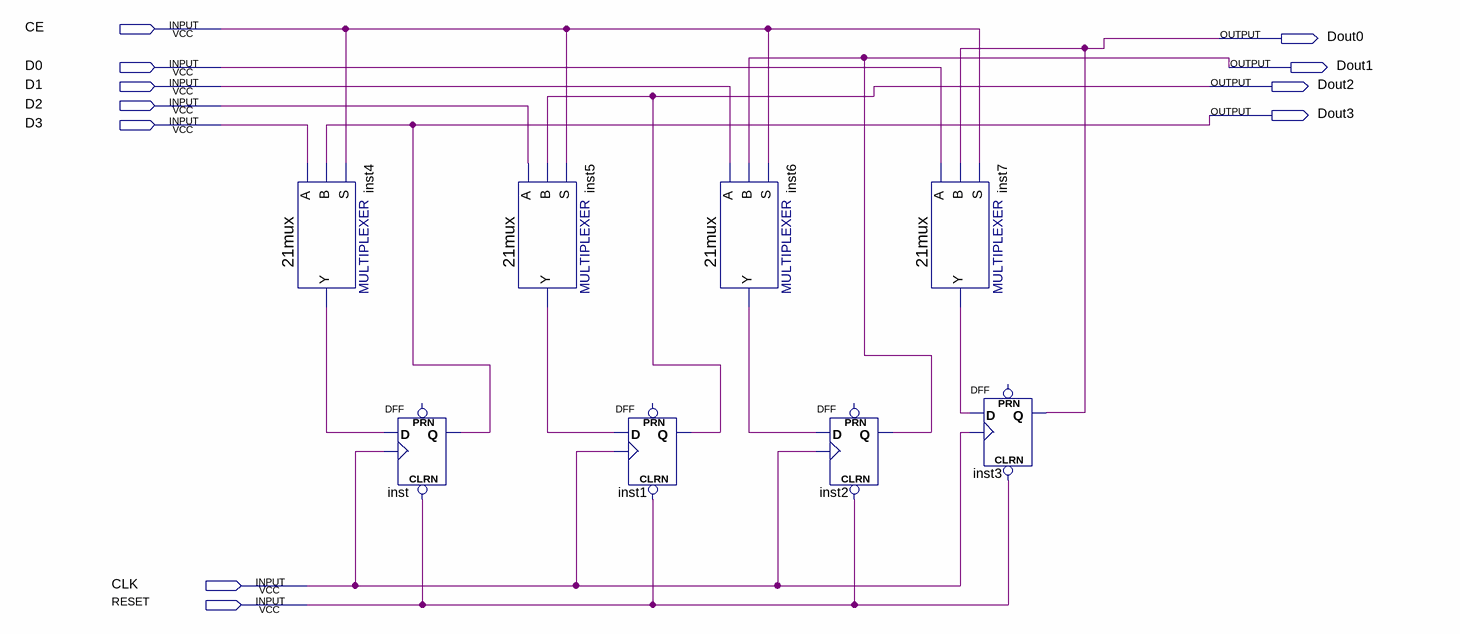
[diagram p0: schematic sheet]
// Quartus schematic hw3_4.bdf as structural Verilog: 8 symbols, 11 pins
module hw3_4 (
  input  CE,
  input  D0,
  input  D1,
  input  D2,
  input  D3,
  input  CLK,
  input  RESET,
  output Dout0,
  output Dout1,
  output Dout2,
  output Dout3
);

  wire inst4_y, inst5_y, inst6_y, inst7_y;

  \21mux  inst4 (.S(CE), .B(Dout3), .A(D3), .Y(inst4_y));
  DFF inst (.CLRN(RESET), .CLK(CLK), .D(inst4_y), .Q(Dout3));  // open: PRN
  \21mux  inst5 (.S(CE), .B(Dout2), .A(D2), .Y(inst5_y));
  DFF inst1 (.CLRN(RESET), .CLK(CLK), .D(inst5_y), .Q(Dout2));  // open: PRN
  \21mux  inst6 (.S(CE), .B(Dout1), .A(D1), .Y(inst6_y));
  DFF inst2 (.CLRN(RESET), .CLK(CLK), .D(inst6_y), .Q(Dout1));  // open: PRN
  \21mux  inst7 (.S(CE), .B(Dout0), .A(D0), .Y(inst7_y));
  DFF inst3 (.CLRN(RESET), .CLK(CLK), .D(inst7_y), .Q(Dout0));  // open: PRN
endmodule
